# EAGLE schematic Proton Schematic Eagle (EAGLE 9.6.2)
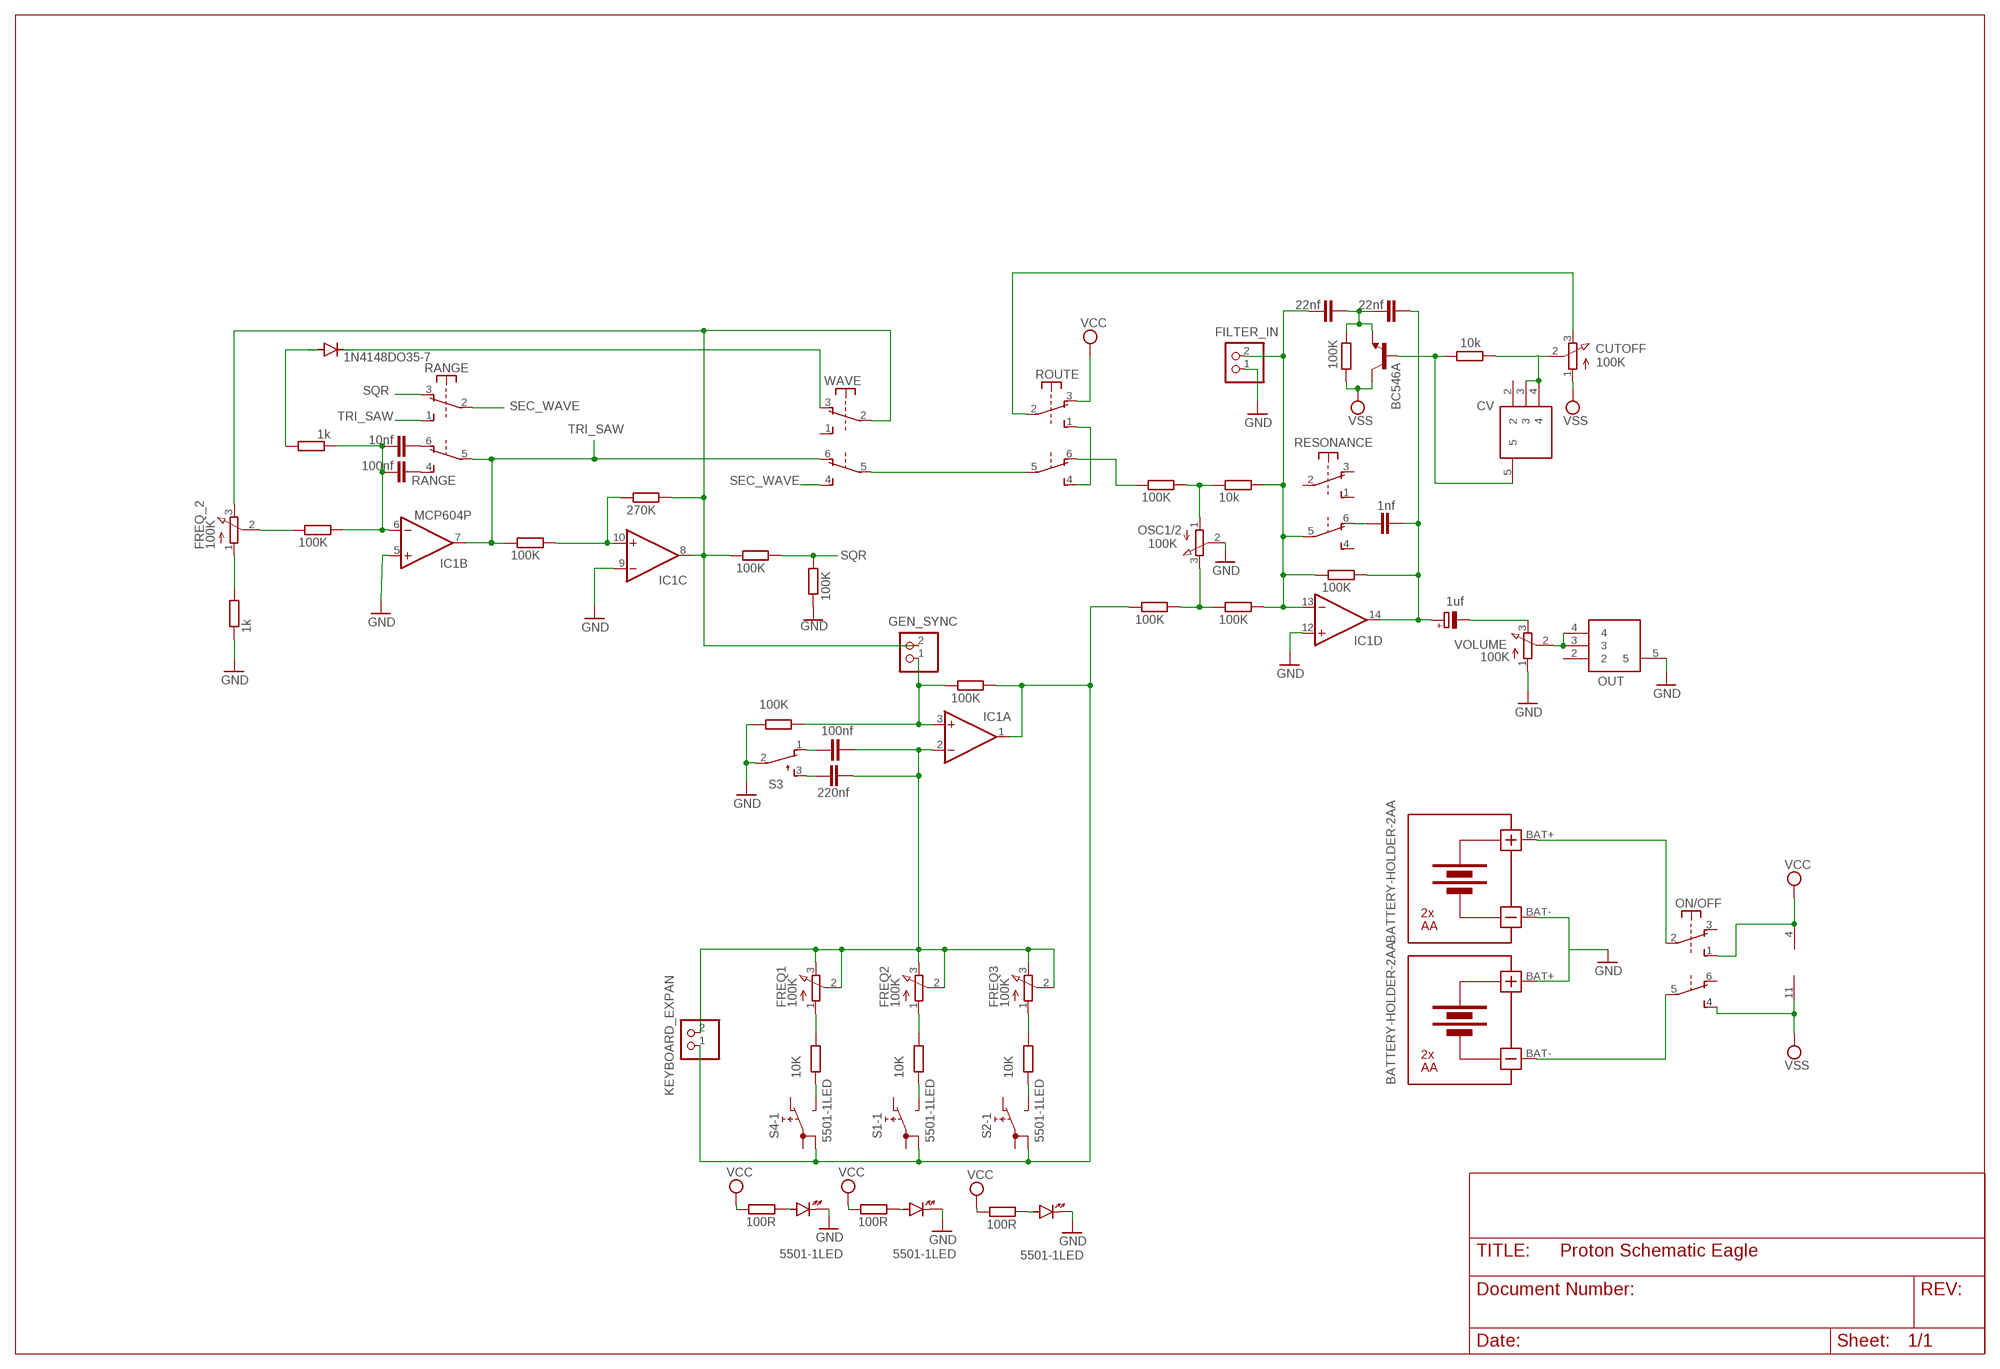
[diagram p0: schematic, sheet 1]

## Parts
1K  1k  R-EU_0207/10  [0207/10]
1K1  1k  R-EU_0207/10  [0207/10]
100K  100K  R-EU_0207/10  [0207/10]
100K1  100K  R-EU_0207/10  [0207/10]
100K2  270K  R-EU_0207/10  [0207/10]
100K3  100K  R-EU_0207/10  [0207/10]
100K4  100K  R-EU_0207/10  [0207/10]
100K5  100K  R-EU_0207/10  [0207/10]
100K6  10k  R-EU_0207/10  [0207/10]
100K7  100K  R-EU_0207/10  [0207/10]
100K8  100K  R-EU_0207/10  [0207/10]
100K9  100K  R-EU_0207/10  [0207/10]
100K10  10k  R-EU_0207/10  [0207/10]
100K11  100K  R-EU_0207/10  [0207/10]
100K12  100K  R-EU_0207/10  [0207/10]
100K13  100K  R-EU_0207/10  [0207/10]
100K14  10K  R-EU_0207/10  [0207/10]
100K15  10K  R-EU_0207/10  [0207/10]
100K16  10K  R-EU_0207/10  [0207/10]
100K18  100R  R-EU_0207/10  [0207/10]
100K19  100R  R-EU_0207/10  [0207/10]
100K20  100R  R-EU_0207/10  [0207/10]
C1  100nf  C-EU050-024X044  [C050-024X044]
C2  10nf  C-EU050-024X044  [C050-024X044]
C3  22nf  C-EU050-024X044  [C050-024X044]
C4  22nf  C-EU050-024X044  [C050-024X044]
C5  1nf  C-EU050-024X044  [C050-024X044]
C6  220nf  C-EU050-024X044  [C050-024X044]
C7  100nf  C-EU050-024X044  [C050-024X044]
C8  1uf  CPOL-EUE2.5-5  [E2,5-5]
CUTOFF  100K  EVUF2M  [EVUFXM]
CV  PJ-320A  [PJ320A]
D1  1N4148DO35-7  [DO35-7]
FILTER_IN  PINHD-1X2  [1X02]
FREQ1  100K  EVUF2M  [EVUFXM]
FREQ2  100K  EVUF2M  [EVUFXM]
FREQ3  100K  EVUF2M  [EVUFXM]
FREQ_2  100K  EVUF2M  [EVUFXM]
GEN_SYNC  PINHD-1X2  [1X02]
IC1  MCP604P  [DIL14]
KEYBOARD_EXPAN  PINHD-1X2  [1X02]
ON/OFF  SWITCH-6PIN  [SWITCH-6PIN]
OSC1/2  100K  EVUF2M  [EVUFXM]
OUT  PJ-320A  [PJ320A]
Q1  BC546A  [TO92-EBC]
RANGE  SWITCH-6PIN  [SWITCH-6PIN]
RESONANCE  SWITCH-6PIN  [SWITCH-6PIN]
ROUTE  SWITCH-6PIN  [SWITCH-6PIN]
S1  5501-1LED  [5501-1LED]
S2  5501-1LED  [5501-1LED]
S3  TL32YO  [TL3XYO]
S4  5501-1LED  [5501-1LED]
U$1  BATTERY-HOLDER-2AA  [BATTERY-HOLDER-2AA]
U$2  BATTERY-HOLDER-2AA  [BATTERY-HOLDER-2AA]
VOLUME  100K  EVUF2M  [EVUFXM]
WAVE  SWITCH-6PIN  [SWITCH-6PIN]

## Nets
GND: 1K.1 100K4.1 100K13.1 FILTER_IN.1 IC1.5(B:+IN) IC1.9(C:-IN) IC1.12(D:+IN) OSC1/2.2(S) OUT.5 S1.-(-LED:K) S2.-(-LED:K) S3.2(P) S4.-(-LED:K) U$1.BAT- U$2.BAT+ VOLUME.1(A)
N$1: 100K1.2 100K2.1 IC1.10(C:+IN)
N$2: 100K.1 FREQ_2.2(S)
N$3: 1K.2 FREQ_2.1(A)
N$4: C1.2 RANGE.4(2:S)
N$5: C2.2 RANGE.6(2:O)
N$6: 1K1.1 100K.2 C1.1 C2.1 IC1.6(B:-IN)
N$7: ROUTE.5(2:P) WAVE.5(2:P)
N$8: 1K1.2 D1.A
N$9: 100K2.2 100K3.1 FREQ_2.3(E) GEN_SYNC.2 IC1.8(C:OUT) WAVE.2(1:P)
N$10: D1.C WAVE.3(1:O)
N$11: ROUTE.1(1:S) ROUTE.4(2:S)
N$12: 100K5.1 ROUTE.6(2:O)
N$13: 100K5.2 100K6.1 OSC1/2.1(A)
N$14: 100K18.1 S4.+(-LED:A)
N$15: C8.- VOLUME.3(E)
N$16: 100K9.2 C3.2 C4.1 Q1.E
N$18: CUTOFF.3(E) ROUTE.2(1:P)
N$19: C5.1 RESONANCE.6(2:O)
N$20: 100K11.2 C4.2 C5.2 C8.+ IC1.14(D:OUT)
N$21: 100K7.2 100K8.1 OSC1/2.3(E)
N$22: 100K6.2 100K8.2 100K11.1 C3.1 FILTER_IN.2 IC1.13(D:-IN) RESONANCE.5(2:P)
N$23: 100K19.1 S1.+(-LED:A)
N$24: 100K10.1 CV.5 Q1.B
N$25: 100K20.1 S2.+(-LED:A)
N$26: 100K12.1 100K13.2 GEN_SYNC.1 IC1.3(A:+IN)
N$27: ON/OFF.2(1:P) U$1.BAT+
N$28: C6.2 C7.2 FREQ1.2(S) FREQ1.3(E) FREQ2.2(S) FREQ2.3(E) FREQ3.2(S) FREQ3.3(E) IC1.2(A:-IN) KEYBOARD_EXPAN.2
N$29: 100K14.1 S4.NO(-1:NO)
N$30: 100K15.1 S1.NO(-1:NO)
N$31: 100K16.1 S2.NO(-1:NO)
N$32: 100K7.1 100K12.2 IC1.1(A:OUT) KEYBOARD_EXPAN.1 S1.1B(-1:1B) S2.1B(-1:1B) S4.1B(-1:1B)
N$33: 100K14.2 FREQ1.1(A)
N$34: 100K15.2 FREQ2.1(A)
N$35: 100K16.2 FREQ3.1(A)
N$36: ON/OFF.5(2:P) U$2.BAT-
N$37: C6.1 S3.3(S)
N$38: C7.1 S3.1(O)
N$39: OUT.3 OUT.4 VOLUME.2(S)
N$40: 100K10.2 CUTOFF.2(S) CV.3 CV.4
SEC_WAVE: RANGE.2(1:P) WAVE.4(2:S)
SQR: 100K3.2 100K4.2 RANGE.3(1:O)
TRI_SAW: 100K1.1 IC1.7(B:OUT) RANGE.1(1:S) RANGE.5(2:P) WAVE.6(2:O)
VCC: 100K18.2 100K19.2 100K20.2 IC1.4(P:V+) ON/OFF.1(1:S) ROUTE.3(1:O)
VSS: 100K9.1 CUTOFF.1(A) IC1.11(P:V-) ON/OFF.4(2:S) Q1.C
Unconnected: CV.2 ON/OFF.3(1:O) ON/OFF.6(2:O) OUT.2 RESONANCE.1(1:S) RESONANCE.2(1:P) RESONANCE.3(1:O) RESONANCE.4(2:S) S1.1A(-1:1A) S1.NC(-1:NC) S2.1A(-1:1A) S2.NC(-1:NC) S4.1A(-1:1A) S4.NC(-1:NC) WAVE.1(1:S)

## Library data of the parts
1K 1K1 100K 100K1-100K16 100K18-100K20 = rcl:R-EU_: RESISTOR, European symbol; SPICEPREFIX: R
C1-C7 = rcl:C-EU: CAPACITOR, European symbol; SPICEPREFIX: C
C8 = rcl:CPOL-EU: POLARIZED CAPACITOR, European symbol; SPICEPREFIX: C
CUTOFF FREQ1-FREQ3 FREQ_2 OSC1/2 VOLUME = pot:EVU: 9 mm Square Rotary Potentiometers Source: Panasonic
CV OUT = PJ-320A:PJ-320A: 3.5 mm Audio Jack Connector PCB Mount Female Socket 4 Pin PJ-320A Source: Datasheet <http://www.helloxkb.com/public/images/pdf/PJ-320A-.pdf>; DESCRIPTION: 3.5 mm Audio Jack Connector PCB Mount Female Socket 4 Pin PJ-320A; HEIGHT: 5.3mm; MANUFACTURER_NAME: XKB Connectivity; MANUFACTURER_PART_NUMBER: PJ-320A
D1 = diode:1N4148: DIODE high speed (Philips)
FILTER_IN GEN_SYNC KEYBOARD_EXPAN = pinhead:PINHD-1X2: PIN HEADER
IC1 = linear:MCP604: Quad Op Amp 2.7V to 6.0V Single Supply CMOS Source: http://ww1.microchip.com/downloads/en/DeviceDoc/21314g.pdf
ON/OFF RANGE RESONANCE ROUTE WAVE = My Library:SWITCH-6PIN: ITT SWITCH
Q1 = transistor-npn:BC546*: NPN Transistor
S1 S2 S4 = switch:55?-1LED: PUSHBUTTON SERIES 5500 SWITCHES 1 LED Source: www.e-switch.com .. 5500.pdf
S3 = switch:TL32YO: TINY SWITCH ON - MOM Source: http://www2.produktinfo.conrad.com/datenblaetter/700000-724999/705152-da-01-de-Subminiaturschalter_TL_36YO.pdf
U$1 U$2 = My Library:BATTERY-HOLDER-2AA: Battery Holder 2 x AA Click here to find device on ebay.com <http://www.ebay.com/sch/battery+plastic+holder+aa+2x1.5v>